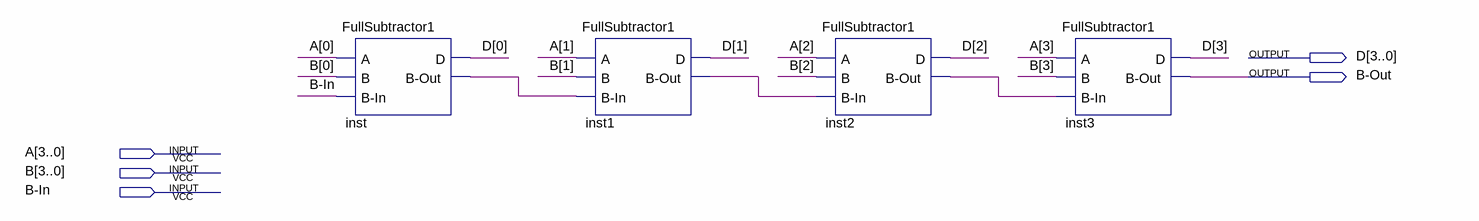
[diagram p0: schematic sheet]
// Quartus schematic FullSubtractor4.bdf as structural Verilog: 4 symbols, 5 pins
module FullSubtractor4 (
  input  [3:0] A,
  input  [3:0] B,
  input  \B-In ,
  output [3:0] D,
  output \B-Out 
);

  wire inst1_b_out, inst2_b_out, inst_b_out;

  FullSubtractor1 inst (.A(A[0]), .B(B[0]), .\B-In (\B-In ), .D(D[0]), .\B-Out (inst_b_out));
  FullSubtractor1 inst1 (.A(A[1]), .B(B[1]), .\B-In (inst_b_out), .D(D[1]), .\B-Out (inst1_b_out));
  FullSubtractor1 inst2 (.A(A[2]), .B(B[2]), .\B-In (inst1_b_out), .D(D[2]), .\B-Out (inst2_b_out));
  FullSubtractor1 inst3 (.A(A[3]), .B(B[3]), .\B-In (inst2_b_out), .D(D[3]), .\B-Out (\B-Out ));
endmodule
